# Altium schematic sheet AMP.SchDoc
size A4; SheetNumber: 7; SheetTotal: 10
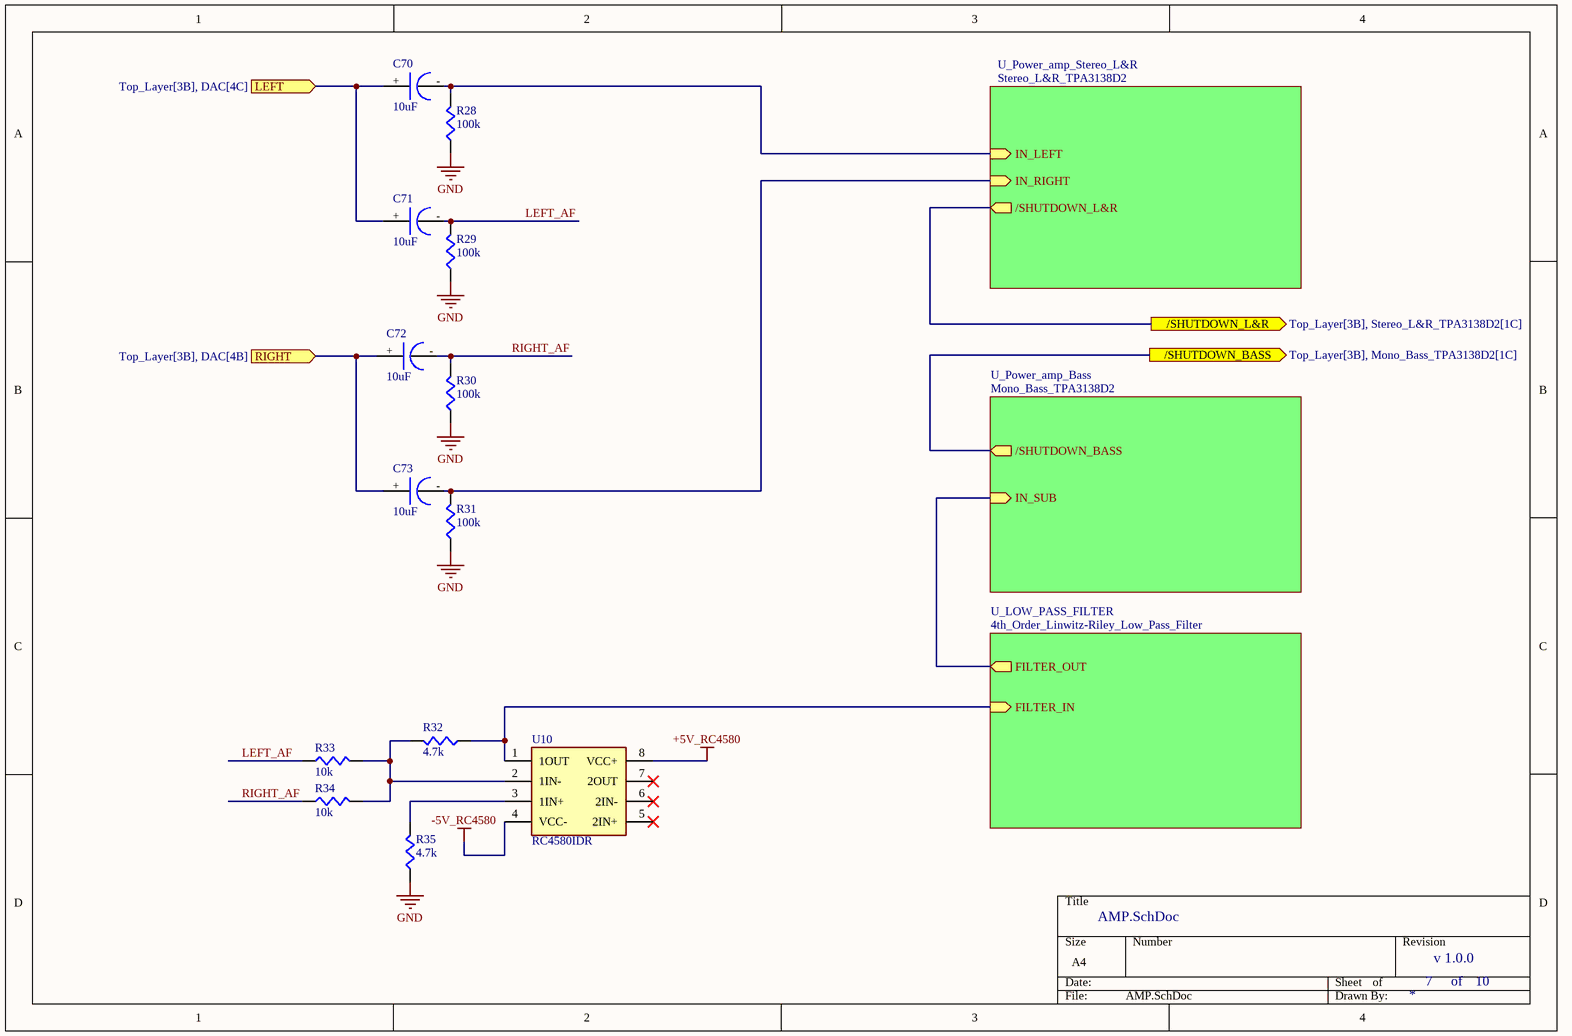
[diagram p0: AMP.SchDoc]

## Parts
C70  10uF  [CAPD6.3XL5.8X61M]
C71  10uF  [CAPD6.3XL5.8X61M]
C72  10uF  [CAPD6.3XL5.8X61M]
C73  10uF  [CAPD6.3XL5.8X61M]
R28  100k  [RECS0603X45N]
R29  100k  [RECS0603X45N]
R30  100k  [RECS0603X45N]
R31  100k  [RECS0603X45N]
R32  4.7k  [RECS0603X45N]
R33  10k  [RECS0603X45N]
R34  10k  [RECS0603X45N]
R35  4.7k  [RECS0603X45N]
U10  RC4580IDR  [SOIC127P600X175-8N]

## Sub-sheets
U_LOW_PASS_FILTER = 4th_Order_Linwitz-Riley_Low_Pass_Filter: FILTER_IN (in), FILTER_OUT (out)
U_Power_amp_Bass = Mono_Bass_TPA3138D2: IN_SUB (in), /SHUTDOWN_BASS (out)
U_Power_amp_Stereo_L&R = Stereo_L&R_TPA3138D2: IN_LEFT (in), IN_RIGHT (in), /SHUTDOWN_L&R (out)

## Ports
/SHUTDOWN_BASS (out, see Top_Layer[3B], Mono_Bass_TPA3138D2[1C]), /SHUTDOWN_L&R (out, see Top_Layer[3B], Stereo_L&R_TPA3138D2[1C]), LEFT (in, see Top_Layer[3B], DAC[4C]), RIGHT (in, see Top_Layer[3B], DAC[4B])

## Nets
+5V_RC4580: U10.8(VCC+)
-5V_RC4580: U10.4(VCC-)
GND: R28.1 R29.1 R30.1 R31.1 R35.1
/SHUTDOWN_BASS: port /SHUTDOWN_BASS, sheet U_Power_amp_Bass//SHUTDOWN_BASS
/SHUTDOWN_L&R: port /SHUTDOWN_L&R, sheet U_Power_amp_Stereo_L&R//SHUTDOWN_L&R
LEFT: C70.1 C71.1 ; port LEFT
LEFT_AF: C71.2 R29.2 R33.1
RIGHT: C72.1 C73.1 ; port RIGHT
RIGHT_AF: C72.2 R30.2 R34.1
NetC70_2: C70.2 R28.2 ; sheet U_Power_amp_Stereo_L&R/IN_LEFT
NetC73_2: C73.2 R31.2 ; sheet U_Power_amp_Stereo_L&R/IN_RIGHT
NetR32_1: R32.1 U10.1(1OUT) ; sheet U_LOW_PASS_FILTER/FILTER_IN
NetR32_2: R32.2 R33.2 R34.2 U10.2(1IN-)
NetR35_2: R35.2 U10.3(1IN+)
(unnamed): sheet U_Power_amp_Bass/IN_SUB, sheet U_LOW_PASS_FILTER/FILTER_OUT

Not connected (* = marked no-connect by the designer): U10 5(2IN+)* 6(2IN-)* 7(2OUT)*

## Notes on the sheet
- v 1.0.0
- of
- (in symbol CPD6.3XL5.8_10uF_POLYMER) +; -

## Library data of the parts
C70-C73 = CPD6.3XL5.8_10uF_POLYMER: C5246550, HV1V106M0605PZ, -55℃~+105℃ 10uF 2.2mm 2000hrs 35V 5.8mm 6.3mm ±20% SMD,D6.3xL5.8mm Polymer Aluminum Capacitors ROHS; Supplier 1: LCSC; Supplier Part Number 1: C5246550
R28-R31 = RESC0603_100K_THIN: C116674, AC0603FR-07100KL, -55℃~+155℃ 100kΩ 100mW 75V Thick Film Resistor ±1% ±100ppm/℃ 0603 Chip Resistor - Surface Mount ROHS; Supplier 1: element14 APAC; Supplier Part Number 1: AC0603FR-07100KL
R32 R35 = RESC0603_4.7K_THIN: C513565, RT0603BRD074K7L, -55℃~+155℃ 100mW 4.7kΩ 75V Thin Film Resistor ±0.1% ±25ppm/℃ 0603 Chip Resistor - Surface Mount ROHS; Supplier 1: Avnet; Supplier Part Number 1: RT0603BRD074K7L
R33 R34 = RESC0603_10K_THIN: C95204, RT0603BRD0710KL, -55℃~+155℃ 100mW 10kΩ 75V Thin Film Resistor ±0.1% ±25ppm/℃ 0603 Chip Resistor - Surface Mount ROHS; Supplier 1: Avnet; Supplier Part Number 1: RT0603BRD0710KL
U10 = RC4580IDR: C80100, RC4580IDR, -16V~-2V、2V~16V -40℃~+85℃ 0.0005% 110dB 2-Channel 9mA SOIC-8 Audio Amplifiers ROHS; Manufacturer_Name: Texas Instruments; Datasheet Link: http://www.ti.com/lit/gpn/rc4580; Height: 1.75mm; Manufacturer_Part_Number: RC4580IDR; Mouser Part Number: 595-RC4580IDR; Mouser Price/Stock: https://www.mouser.co.uk/ProductDetail/Texas-Instruments/RC4580IDR?qs=sSOk4GDDv7xt5SOlVrtkww%3D%3D; Arrow Part Number: RC4580IDR; Arrow Price/Stock: https://www.arrow.com/en/products/rc4580idr/texas-instruments?region=nac; Supplier 1: Rochester Electronics; Supplier Part Number 1: RC4580IDR